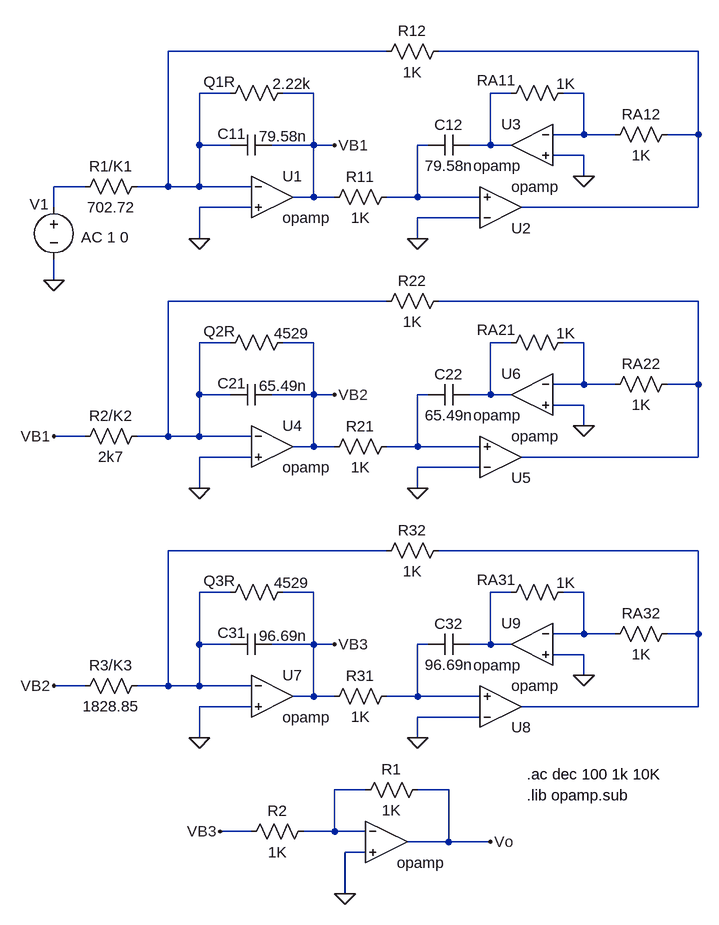
[diagram p0: schematic ej7.asc]
ej7.asc, the LTspice schematic file:
Version 4
SHEET 1 880 1204
WIRE 176 -160 -160 -160
WIRE 656 -160 256 -160
WIRE -64 -96 -112 -96
WIRE 64 -96 16 -96
WIRE 368 -96 336 -96
WIRE 480 -96 448 -96
WIRE 480 -32 480 -96
WIRE 480 -32 432 -32
WIRE 528 -32 480 -32
WIRE 656 -32 656 -160
WIRE 656 -32 608 -32
WIRE -112 -16 -112 -96
WIRE -64 -16 -112 -16
WIRE 64 -16 64 -96
WIRE 64 -16 0 -16
WIRE 96 -16 64 -16
WIRE 240 -16 224 -16
WIRE 336 -16 336 -96
WIRE 336 -16 304 -16
WIRE 368 -16 336 -16
WIRE 480 0 432 0
WIRE 480 32 480 0
WIRE -288 48 -336 48
WIRE -160 48 -160 -160
WIRE -160 48 -208 48
WIRE -112 48 -112 -16
WIRE -112 48 -160 48
WIRE -32 48 -112 48
WIRE 64 64 64 -16
WIRE 64 64 32 64
WIRE 96 64 64 64
WIRE 224 64 224 -16
WIRE 224 64 176 64
WIRE 320 64 224 64
WIRE -336 80 -336 48
WIRE -32 80 -112 80
WIRE 656 80 656 -32
WIRE 656 80 384 80
WIRE 320 96 224 96
WIRE -112 128 -112 80
WIRE 224 128 224 96
WIRE -336 192 -336 160
WIRE 176 224 -160 224
WIRE 656 224 256 224
WIRE -64 288 -112 288
WIRE 64 288 16 288
WIRE 368 288 336 288
WIRE 480 288 448 288
WIRE 480 352 480 288
WIRE 480 352 432 352
WIRE 528 352 480 352
WIRE 656 352 656 224
WIRE 656 352 608 352
WIRE -112 368 -112 288
WIRE -64 368 -112 368
WIRE 64 368 64 288
WIRE 64 368 0 368
WIRE 96 368 64 368
WIRE 240 368 224 368
WIRE 336 368 336 288
WIRE 336 368 304 368
WIRE 368 368 336 368
WIRE 480 384 432 384
WIRE 480 416 480 384
WIRE -288 432 -336 432
WIRE -160 432 -160 224
WIRE -160 432 -208 432
WIRE -112 432 -112 368
WIRE -112 432 -160 432
WIRE -32 432 -112 432
WIRE 64 448 64 368
WIRE 64 448 32 448
WIRE 96 448 64 448
WIRE 224 448 224 368
WIRE 224 448 176 448
WIRE 320 448 224 448
WIRE -32 464 -112 464
WIRE 656 464 656 352
WIRE 656 464 384 464
WIRE 320 480 224 480
WIRE -112 512 -112 464
WIRE 224 512 224 480
WIRE 176 608 -160 608
WIRE 656 608 256 608
WIRE -64 672 -112 672
WIRE 64 672 16 672
WIRE 368 672 336 672
WIRE 480 672 448 672
WIRE 480 736 480 672
WIRE 480 736 432 736
WIRE 528 736 480 736
WIRE 656 736 656 608
WIRE 656 736 608 736
WIRE -112 752 -112 672
WIRE -64 752 -112 752
WIRE 64 752 64 672
WIRE 64 752 0 752
WIRE 96 752 64 752
WIRE 240 752 224 752
WIRE 336 752 336 672
WIRE 336 752 304 752
WIRE 368 752 336 752
WIRE 480 768 432 768
WIRE 480 800 480 768
WIRE -288 816 -336 816
WIRE -160 816 -160 608
WIRE -160 816 -208 816
WIRE -112 816 -112 752
WIRE -112 816 -160 816
WIRE -32 816 -112 816
WIRE 64 832 64 752
WIRE 64 832 32 832
WIRE 96 832 64 832
WIRE 224 832 224 752
WIRE 224 832 176 832
WIRE 320 832 224 832
WIRE -32 848 -112 848
WIRE 656 848 656 736
WIRE 656 848 384 848
WIRE 320 864 224 864
WIRE -112 896 -112 848
WIRE 224 896 224 864
WIRE 144 976 96 976
WIRE 272 976 224 976
WIRE -32 1040 -80 1040
WIRE 96 1040 96 976
WIRE 96 1040 48 1040
WIRE 144 1040 96 1040
WIRE 272 1056 272 976
WIRE 272 1056 208 1056
WIRE 336 1056 272 1056
WIRE 144 1072 112 1072
WIRE 112 1136 112 1072
FLAG -112 128 0
FLAG 224 128 0
FLAG -336 192 0
FLAG 480 32 0
FLAG 96 -16 VB1
FLAG -112 512 0
FLAG 224 512 0
FLAG 480 416 0
FLAG 96 368 VB2
FLAG -336 432 VB1
FLAG -112 896 0
FLAG 224 896 0
FLAG 480 800 0
FLAG 96 752 VB3
FLAG -336 816 VB2
FLAG 336 1056 Vo
FLAG -80 1040 VB3
FLAG 112 1136 0
SYMBOL Opamps\\opamp 0 0 R0
SYMATTR InstName U1
SYMBOL Opamps\\opamp 352 144 M180
SYMATTR InstName U2
SYMBOL Opamps\\opamp 400 -80 M0
SYMATTR InstName U3
SYMBOL res 192 48 R90
WINDOW 0 0 56 VBottom 2
WINDOW 3 32 56 VTop 2
SYMATTR InstName R11
SYMATTR Value 1K
SYMBOL cap 0 -32 R90
WINDOW 0 14 62 VBottom 2
WINDOW 3 -13 -17 VTop 2
SYMATTR InstName C11
SYMATTR Value 79.58n
SYMBOL res 32 -112 R90
WINDOW 0 14 113 VBottom 2
WINDOW 3 -14 2 VTop 2
SYMATTR InstName Q1R
SYMATTR Value 2.22k
SYMBOL res -192 32 R90
WINDOW 0 0 56 VBottom 2
WINDOW 3 32 56 VTop 2
SYMATTR InstName R1/K1
SYMATTR Value 702.72
SYMBOL voltage -336 64 R0
WINDOW 0 -37 11 Left 2
WINDOW 3 -34 97 Left 2
WINDOW 123 42 62 Left 2
WINDOW 39 0 0 Left 0
SYMATTR InstName V1
SYMATTR Value ""
SYMATTR Value2 AC 1 0
SYMBOL res 272 -176 R90
WINDOW 0 0 56 VBottom 2
WINDOW 3 32 56 VTop 2
SYMATTR InstName R12
SYMATTR Value 1K
SYMBOL cap 304 -32 R90
WINDOW 0 0 32 VBottom 2
WINDOW 3 32 32 VTop 2
SYMATTR InstName C12
SYMATTR Value 79.58n
SYMBOL res 464 -112 R90
WINDOW 0 12 119 VBottom 2
WINDOW 3 -14 12 VTop 2
SYMATTR InstName RA11
SYMATTR Value 1K
SYMBOL res 624 -48 R90
WINDOW 0 0 56 VBottom 2
WINDOW 3 32 56 VTop 2
SYMATTR InstName RA12
SYMATTR Value 1K
SYMBOL Opamps\\opamp 0 384 R0
SYMATTR InstName U4
SYMBOL Opamps\\opamp 352 528 M180
SYMATTR InstName U5
SYMBOL Opamps\\opamp 400 304 M0
SYMATTR InstName U6
SYMBOL res 192 432 R90
WINDOW 0 0 56 VBottom 2
WINDOW 3 32 56 VTop 2
SYMATTR InstName R21
SYMATTR Value 1K
SYMBOL cap 0 352 R90
WINDOW 0 14 62 VBottom 2
WINDOW 3 -13 -17 VTop 2
SYMATTR InstName C21
SYMATTR Value 65.49n
SYMBOL res 32 272 R90
WINDOW 0 14 113 VBottom 2
WINDOW 3 -14 2 VTop 2
SYMATTR InstName Q2R
SYMATTR Value 4529
SYMBOL res -192 416 R90
WINDOW 0 0 56 VBottom 2
WINDOW 3 32 56 VTop 2
SYMATTR InstName R2/K2
SYMATTR Value 2k7
SYMBOL res 272 208 R90
WINDOW 0 0 56 VBottom 2
WINDOW 3 32 56 VTop 2
SYMATTR InstName R22
SYMATTR Value 1K
SYMBOL cap 304 352 R90
WINDOW 0 0 32 VBottom 2
WINDOW 3 32 32 VTop 2
SYMATTR InstName C22
SYMATTR Value 65.49n
SYMBOL res 464 272 R90
WINDOW 0 12 119 VBottom 2
WINDOW 3 -14 12 VTop 2
SYMATTR InstName RA21
SYMATTR Value 1K
SYMBOL res 624 336 R90
WINDOW 0 0 56 VBottom 2
WINDOW 3 32 56 VTop 2
SYMATTR InstName RA22
SYMATTR Value 1K
SYMBOL Opamps\\opamp 0 768 R0
SYMATTR InstName U7
SYMBOL Opamps\\opamp 352 912 M180
SYMATTR InstName U8
SYMBOL Opamps\\opamp 400 688 M0
SYMATTR InstName U9
SYMBOL res 192 816 R90
WINDOW 0 0 56 VBottom 2
WINDOW 3 32 56 VTop 2
SYMATTR InstName R31
SYMATTR Value 1K
SYMBOL cap 0 736 R90
WINDOW 0 14 62 VBottom 2
WINDOW 3 -13 -17 VTop 2
SYMATTR InstName C31
SYMATTR Value 96.69n
SYMBOL res 32 656 R90
WINDOW 0 14 113 VBottom 2
WINDOW 3 -14 2 VTop 2
SYMATTR InstName Q3R
SYMATTR Value 4529
SYMBOL res -192 800 R90
WINDOW 0 0 56 VBottom 2
WINDOW 3 32 56 VTop 2
SYMATTR InstName R3/K3
SYMATTR Value 1828.85
SYMBOL res 272 592 R90
WINDOW 0 0 56 VBottom 2
WINDOW 3 32 56 VTop 2
SYMATTR InstName R32
SYMATTR Value 1K
SYMBOL cap 304 736 R90
WINDOW 0 0 32 VBottom 2
WINDOW 3 32 32 VTop 2
SYMATTR InstName C32
SYMATTR Value 96.69n
SYMBOL res 464 656 R90
WINDOW 0 12 119 VBottom 2
WINDOW 3 -14 12 VTop 2
SYMATTR InstName RA31
SYMATTR Value 1K
SYMBOL res 624 720 R90
WINDOW 0 0 56 VBottom 2
WINDOW 3 32 56 VTop 2
SYMATTR InstName RA32
SYMATTR Value 1K
SYMBOL Opamps\\opamp 176 992 R0
WINDOW 0 0 32 Invisible 2
SYMATTR InstName U10
SYMBOL res 240 960 R90
WINDOW 0 0 56 VBottom 2
WINDOW 3 32 56 VTop 2
SYMATTR InstName R1
SYMATTR Value 1K
SYMBOL res 64 1024 R90
WINDOW 0 0 56 VBottom 2
WINDOW 3 32 56 VTop 2
SYMATTR InstName R2
SYMATTR Value 1K
TEXT 392 984 Left 2 !.lib opamp.sub
TEXT 392 952 Left 2 !.ac dec 100 1k 10K

The netlist it stands for:
* ej7.asc
XU1 N001 0 VB1 opamp Aol=100K GBW=10Meg  ; pins invin noninvin out
XU2 0 N005 N002 opamp Aol=100K GBW=10Meg  ; pins invin noninvin out
XU3 N004 0 N003 opamp Aol=100K GBW=10Meg  ; pins invin noninvin out
R11 N005 VB1 1K
C11 VB1 N001 79.58n
R§Q1R VB1 N001 2.22k
R1/K1 N001 N006 702.72
V1 N006 0 AC 1 0
R12 N002 N001 1K
C12 N003 N005 79.58n
RA11 N004 N003 1K
RA12 N002 N004 1K
XU4 N007 0 VB2 opamp Aol=100K GBW=10Meg  ; pins invin noninvin out
XU5 0 N011 N008 opamp Aol=100K GBW=10Meg  ; pins invin noninvin out
XU6 N010 0 N009 opamp Aol=100K GBW=10Meg  ; pins invin noninvin out
R21 N011 VB2 1K
C21 VB2 N007 65.49n
R§Q2R VB2 N007 4529
R2/K2 N007 VB1 2k7
R22 N008 N007 1K
C22 N009 N011 65.49n
RA21 N010 N009 1K
RA22 N008 N010 1K
XU7 N012 0 VB3 opamp Aol=100K GBW=10Meg  ; pins invin noninvin out
XU8 0 N016 N013 opamp Aol=100K GBW=10Meg  ; pins invin noninvin out
XU9 N015 0 N014 opamp Aol=100K GBW=10Meg  ; pins invin noninvin out
R31 N016 VB3 1K
C31 VB3 N012 96.69n
R§Q3R VB3 N012 4529
R3/K3 N012 VB2 1828.85
R32 N013 N012 1K
C32 N014 N016 96.69n
RA31 N015 N014 1K
RA32 N013 N015 1K
XU10 N017 0 Vo opamp Aol=100K GBW=10Meg  ; pins invin noninvin out
R1 Vo N017 1K
R2 N017 VB3 1K
.lib opamp.sub
.ac dec 100 1k 10K
.backanno
.end

* Results of the author's LTspice run, read from the files saved beside the schematic
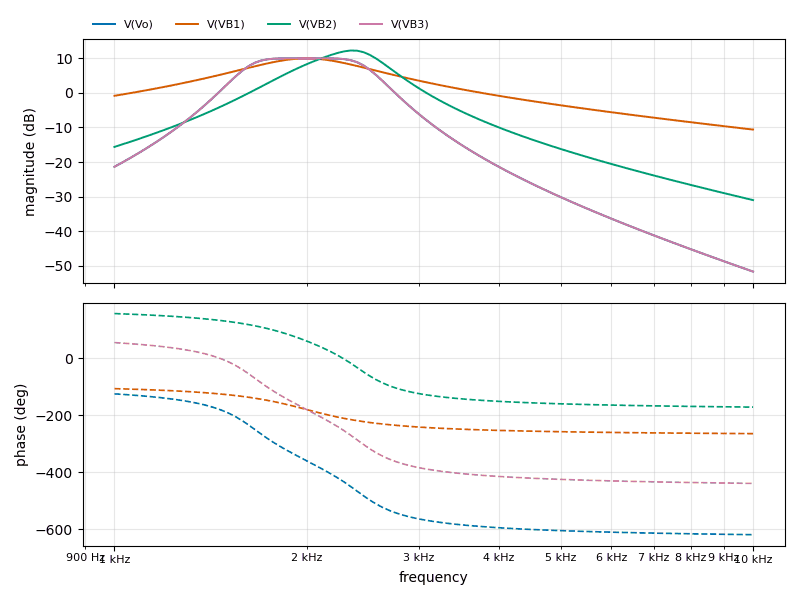
[diagram p1: AC Analysis of ej7.asc, plotted from the saved traces]
* AC Analysis, 1 run:
*   V(Vo): -21.37 dB at 1 kHz, -51.69 dB at 10 kHz, peak 9.99 dB at 1.905 kHz, 3 dB below the peak at 1.601 kHz and 2.498 kHz
*   V(VB1): -0.83 dB at 1 kHz, -10.60 dB at 10 kHz, peak 9.99 dB at 1.995 kHz, 3 dB below the peak at 1.599 kHz and 2.5 kHz
*   V(VB2): -15.61 dB at 1 kHz, -31.01 dB at 10 kHz, peak 12.28 dB at 2.344 kHz, 3 dB below the peak at 2.059 kHz and 2.601 kHz
*   V(VB3): -21.37 dB at 1 kHz, -51.69 dB at 10 kHz, peak 9.99 dB at 1.905 kHz, 3 dB below the peak at 1.601 kHz and 2.498 kHz